# Altium schematic sheet SmartShell_Schematic.SchDoc: SmartShell
size A2
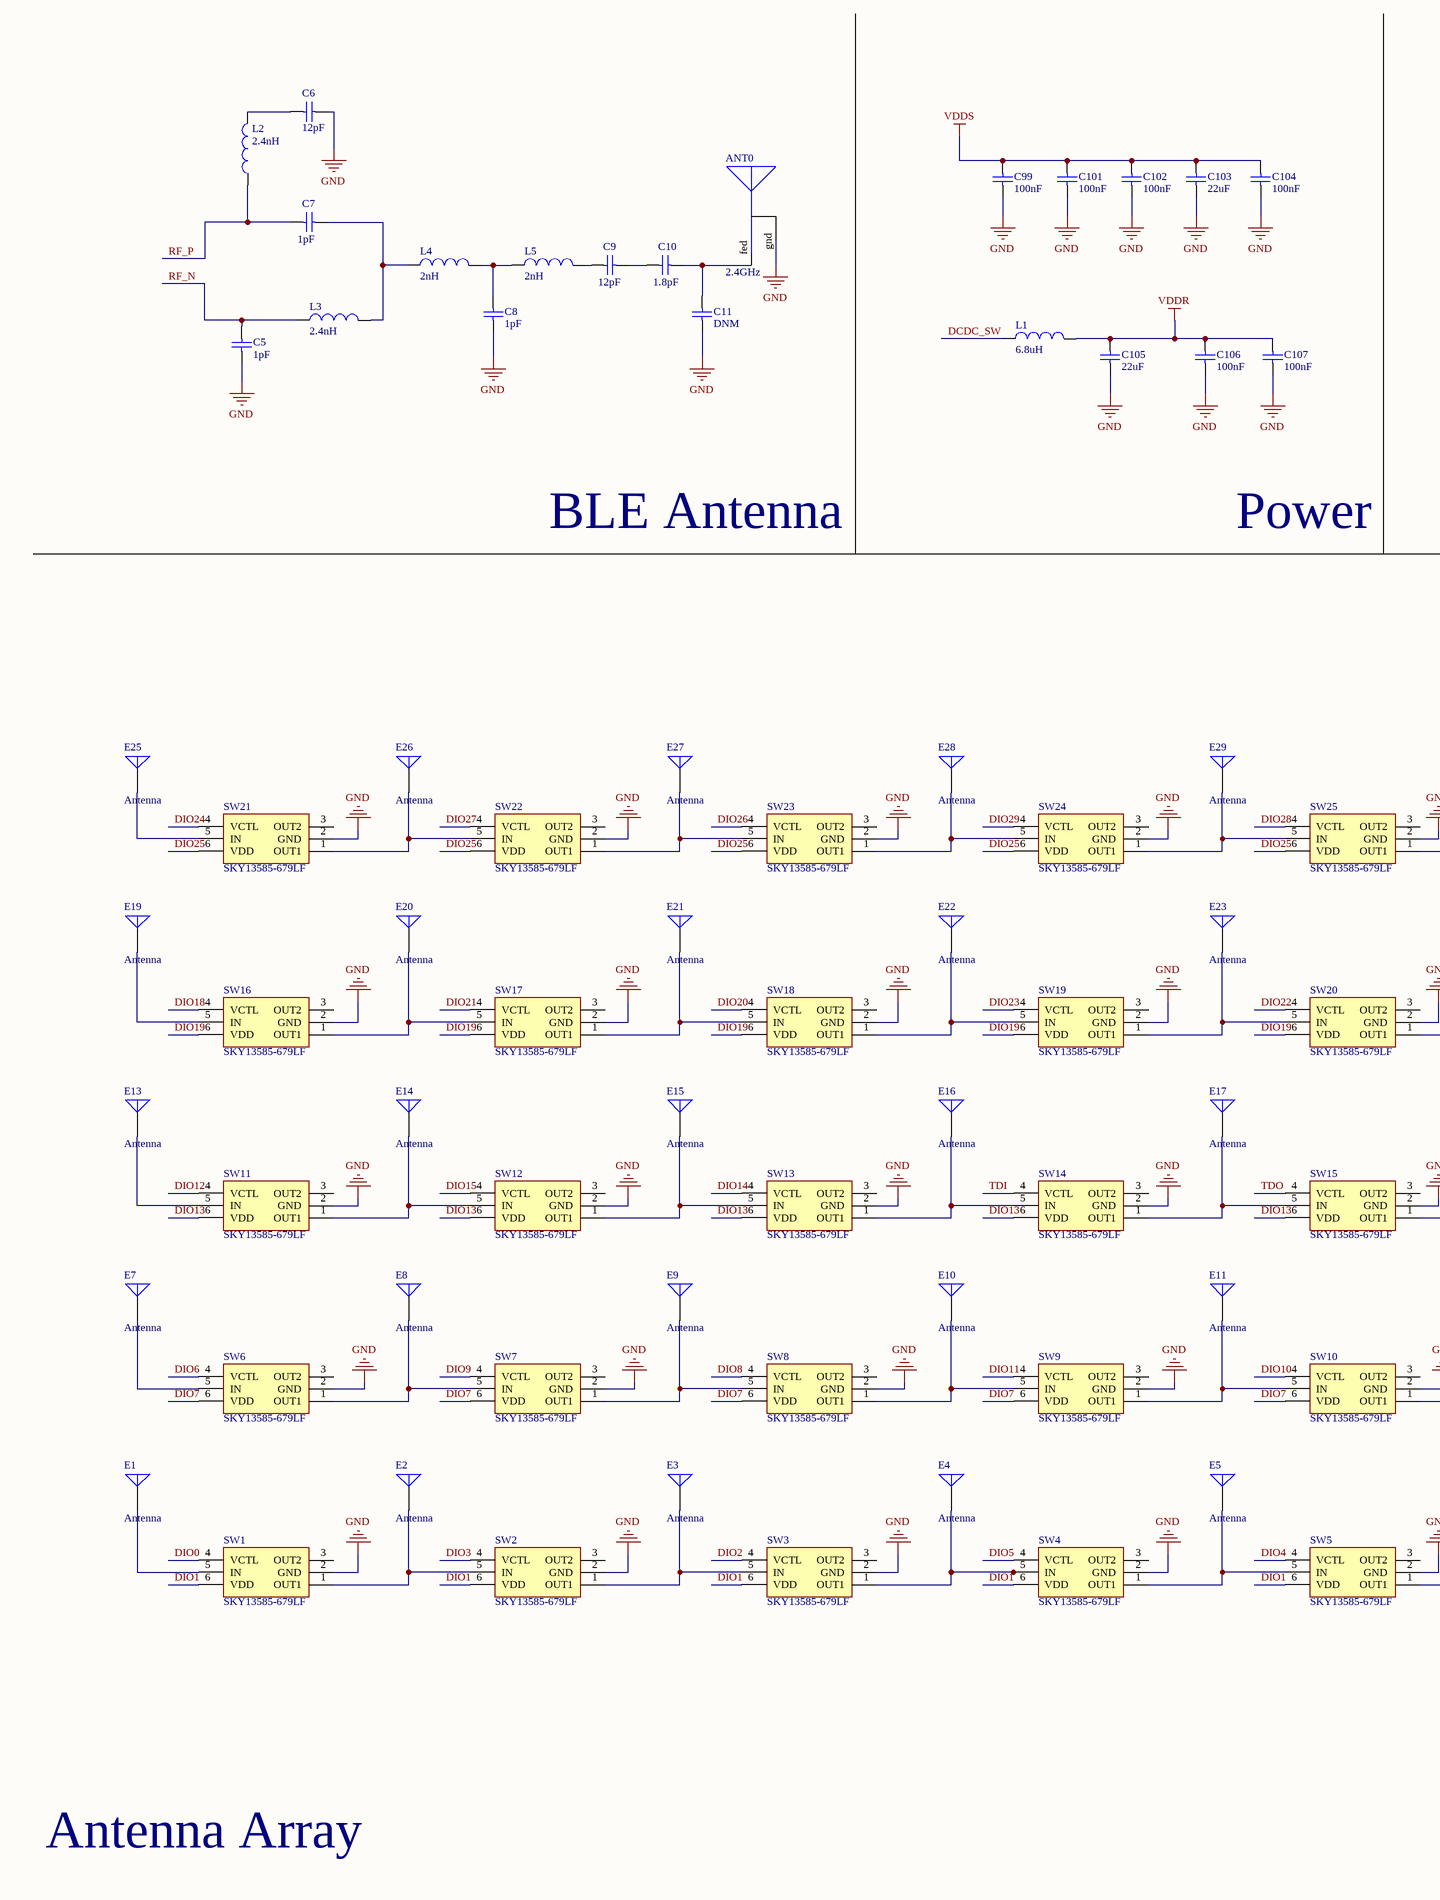
[diagram p0: SmartShell_Schematic.SchDoc, left]
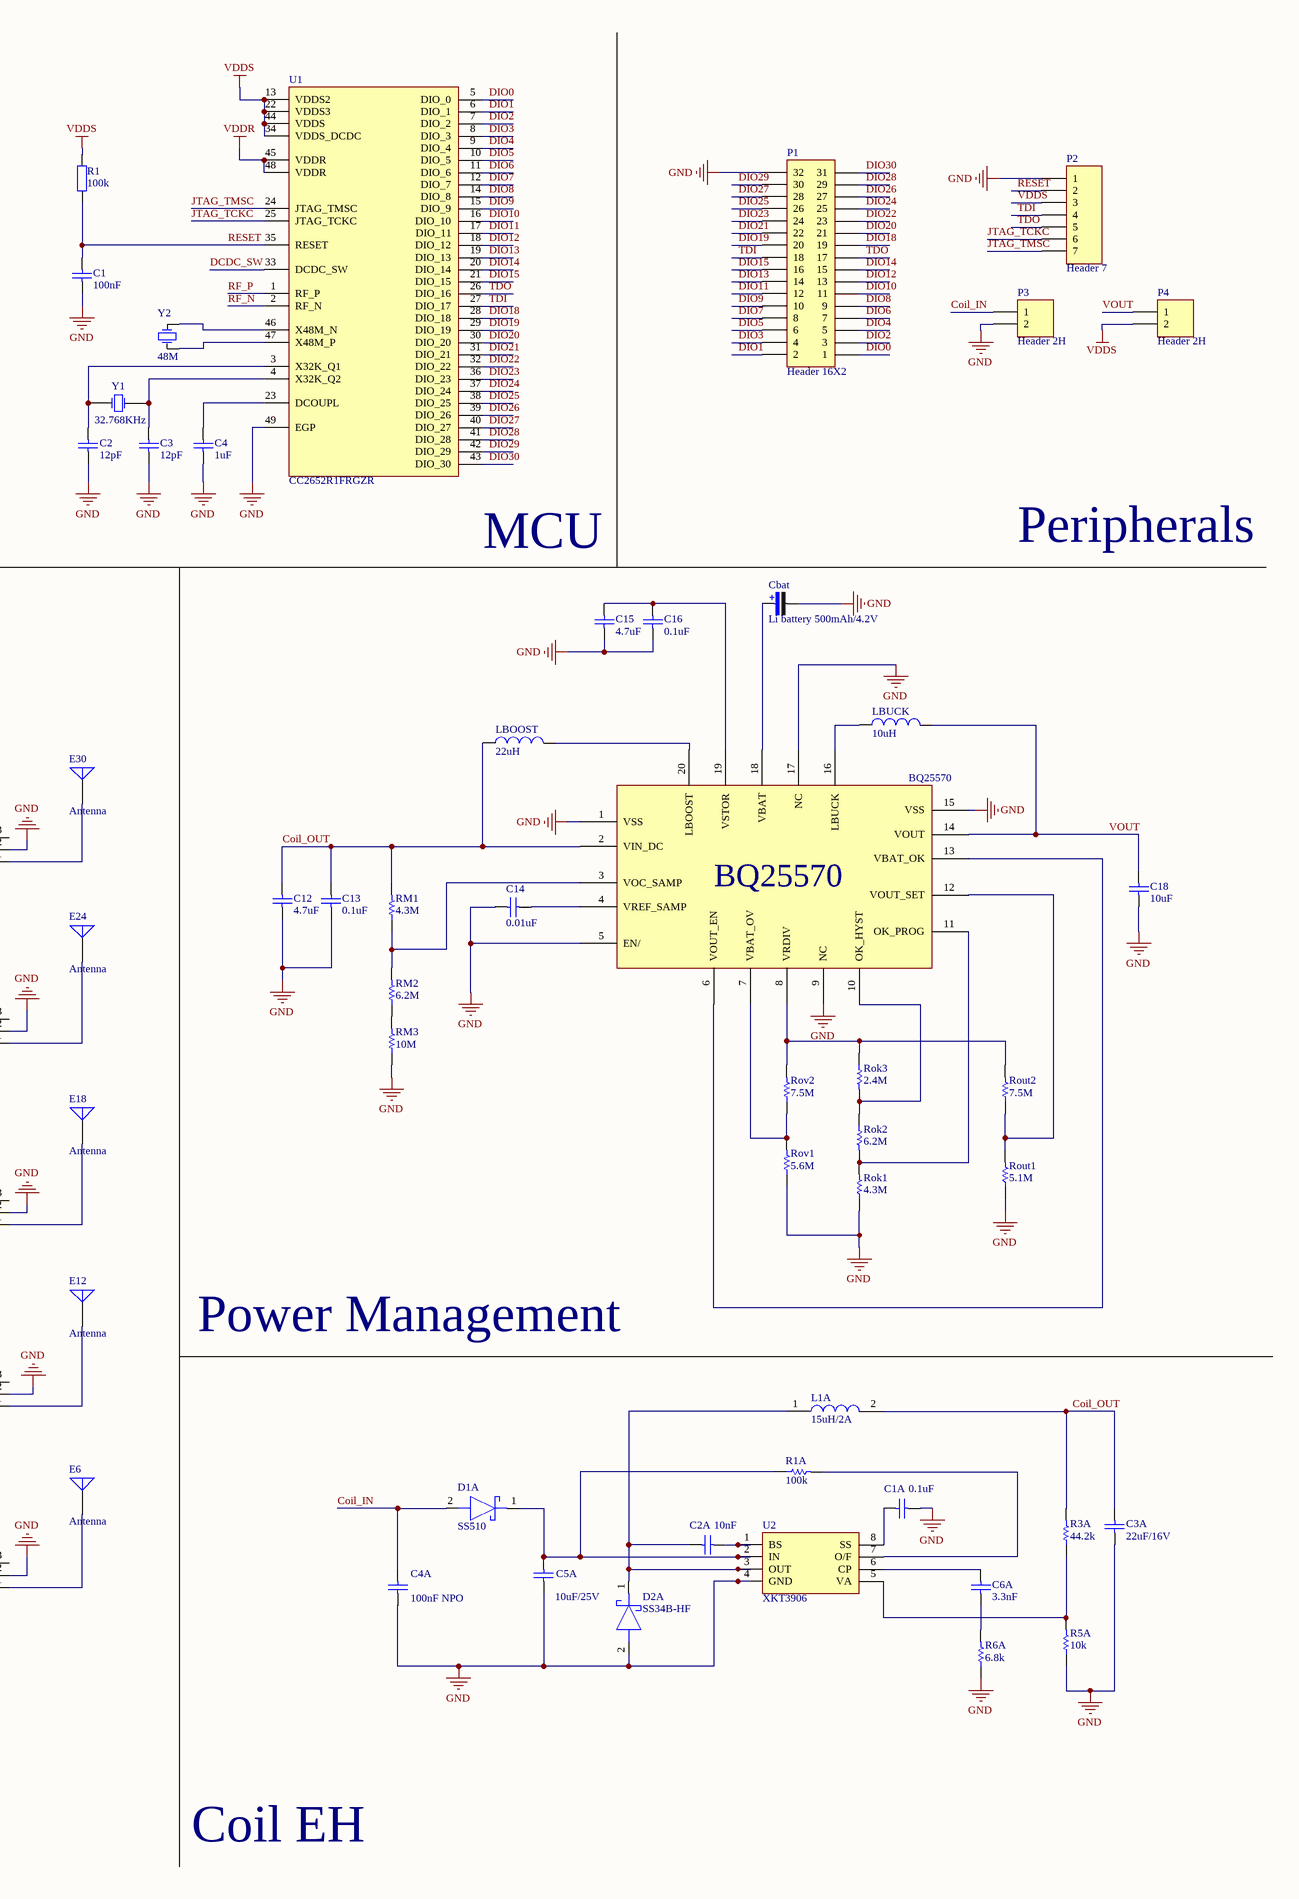
[diagram p1: SmartShell_Schematic.SchDoc, right]

## Parts
ANT0  2.4GHz  [PCBComponent_1]
BQ25570  (no value)
C1  value 100nF  [C-0603]  (hidden comment: Cap-S)
C1A  value 0.1uF  [0603]  (hidden comment: Cap)
C2  value 12pF  [C-0603]  (hidden comment: Cap-S)
C2A  value 10nF  [0603]  (hidden comment: Cap)
C3  value 12pF  [C-0603]  (hidden comment: Cap-S)
C3A  value 22uF/16V  [1206]  (hidden comment: Cap)
C4  value 1uF  [C-0603]  (hidden comment: Cap-S)
C4A  value 100nF NPO  [1206]  (hidden comment: Cap)
C5  value 1pF  [RAD-0.3]
C5A  value 10uF/25V  [1206]  (hidden comment: Cap)
C6  value 12pF  [RAD-0.3]
C6A  value 3.3nF  [0603]  (hidden comment: Cap)
C7  value 1pF  [RAD-0.3]
C8  value 1pF  [RAD-0.3]
C9  value 12pF  [RAD-0.3]
C10  value 1.8pF  [RAD-0.3]
C11  value DNM  [RAD-0.3]
C12  4.7uF  [1608[0603]]
C13  0.1uF  [1608[0603]]
C14  0.01uF  [1608[0603]]
C15  4.7uF  [1608[0603]]
C16  0.1uF  [1608[0603]]
C18  10uF  [1608[0603]]
C99  value 100nF  [C-0603]  (hidden comment: Cap-S)
C101  value 100nF  [C-0603]  (hidden comment: Cap-S)
C102  value 100nF  [C-0603]  (hidden comment: Cap-S)
C103  value 22uF  [C-0603]  (hidden comment: Cap-S)
C104  value 100nF  [C-0603]  (hidden comment: Cap-S)
C105  value 22uF  [C-0603]  (hidden comment: Cap-S)
C106  value 100nF  [C-0603]  (hidden comment: Cap-S)
C107  value 100nF  [C-0603]  (hidden comment: Cap-S)
Cbat  value Li battery 500mAh/4.2V  [C-RB-SD6]  (hidden comment: Cap-Pol-ES)
D1A  SS510  [DIOM7959X262N]
D2A  SS34B-HF  [DIOM5336X320N]
E1  Antenna  [PIN1]
E2  Antenna  [PIN1]
E3  Antenna  [PIN1]
E4  Antenna  [PIN1]
E5  Antenna  [PIN1]
E6  Antenna  [PIN1]
E7  Antenna  [PIN1]
E8  Antenna  [PIN1]
E9  Antenna  [PIN1]
E10  Antenna  [PIN1]
E11  Antenna  [PIN1]
E12  Antenna  [PIN1]
E13  Antenna  [PIN1]
E14  Antenna  [PIN1]
E15  Antenna  [PIN1]
E16  Antenna  [PIN1]
E17  Antenna  [PIN1]
E18  Antenna  [PIN1]
E19  Antenna  [PIN1]
E20  Antenna  [PIN1]
E21  Antenna  [PIN1]
E22  Antenna  [PIN1]
E23  Antenna  [PIN1]
E24  Antenna  [PIN1]
E25  Antenna  [PIN1]
E26  Antenna  [PIN1]
E27  Antenna  [PIN1]
E28  Antenna  [PIN1]
E29  Antenna  [PIN1]
E30  Antenna  [PIN1]
L1  value 6.8uH  [0402-A]
L1A  15uH/2A  [CD73NP331KC]
L2  value 2.4nH  [0402-A]
L3  value 2.4nH  [0402-A]
L4  value 2nH  [0402-A]
L5  value 2nH  [0402-A]
LBOOST  22uH  [0603]
LBUCK  10uH  [0603]
P1  Header 16X2  [HDR2X16]
P2  Header 7  [HDR1X7]
P3  Header 2H  [HDR1X2H]
P4  Header 2H  [HDR1X2H]
R1  value 100k  [0603-1]  (hidden comment: Res1)
R1A  value 100k  [0603]  (hidden comment: Res)
R3A  value 44.2k  [0603]  (hidden comment: Res)
R5A  value 10k  [0603]  (hidden comment: Res)
R6A  value 6.8k  [0603]  (hidden comment: Res)
RM1  4.3M  [0402]
RM2  6.2M  [0402]
RM3  10M  [0402]
Rok1  4.3M  [0402]
Rok2  6.2M  [0402]
Rok3  2.4M  [0402]
Rout1  5.1M  [0402]
Rout2  7.5M  [0402]
Rov1  5.6M  [0402]
Rov2  7.5M  [0402]
SW1  SKY13585-679LF
SW2  SKY13585-679LF
SW3  SKY13585-679LF
SW4  SKY13585-679LF
SW5  SKY13585-679LF
SW6  SKY13585-679LF
SW7  SKY13585-679LF
SW8  SKY13585-679LF
SW9  SKY13585-679LF
SW10  SKY13585-679LF
SW11  SKY13585-679LF
SW12  SKY13585-679LF
SW13  SKY13585-679LF
SW14  SKY13585-679LF
SW15  SKY13585-679LF
SW16  SKY13585-679LF
SW17  SKY13585-679LF
SW18  SKY13585-679LF
SW19  SKY13585-679LF
SW20  SKY13585-679LF
SW21  SKY13585-679LF
SW22  SKY13585-679LF
SW23  SKY13585-679LF
SW24  SKY13585-679LF
SW25  SKY13585-679LF
U1  CC2652R1FRGZR
U2  XKT3906
Y1  32.768KHz  [R38]
Y2  value 48M  [X-HC-49S]  (hidden comment: XTAL)

## Nets
GND: ANT0.gnd BQ25570.1(VSS) BQ25570.5(EN/) BQ25570.9(NC) BQ25570.15(VSS) BQ25570.17(NC) C1.1 C1A.1 C2.1 C3.1 C3A.2 C4.1 C4A.1 C5.2 C5A.1 C6.2 C8.1 C11.1 C12.1 C13.1 C14.2 C15.2 C16.1 C18.1 C99.1 C101.1 C102.1 C103.1 C104.1 C105.1 C106.1 C107.1 Cbat.2 D2A.2(A) P1.32 P2.1 P3.2 R5A.1 R6A.1 RM3.1 Rok1.1 Rout1.1 Rov1.1 SW1.2(GND) SW2.2(GND) SW3.2(GND) SW4.2(GND) SW5.2(GND) SW6.2(GND) SW7.2(GND) SW8.2(GND) SW9.2(GND) SW10.2(GND) SW11.2(GND) SW12.2(GND) SW13.2(GND) SW14.2(GND) SW15.2(GND) SW16.2(GND) SW17.2(GND) SW18.2(GND) SW19.2(GND) SW20.2(GND) SW21.2(GND) SW22.2(GND) SW23.2(GND) SW24.2(GND) SW25.2(GND) U1.49(EGP) U2.4(GND)
VDDR: C105.2 C106.2 C107.2 L1.2 U1.45(VDDR) U1.48(VDDR)
VDDS: C99.2 C101.2 C102.2 C103.2 C104.2 P2.3 P4.2 R1.2 U1.13(VDDS2) U1.22(VDDS3) U1.34(VDDS_DCDC) U1.44(VDDS)
Coil_IN: C4A.2 D1A.2(A) P3.1
Coil_OUT: BQ25570.2(VIN_DC) C3A.1 C12.2 C13.2 L1A.2 LBOOST.1 R3A.2 RM1.2
DCDC_SW: L1.1 U1.33(DCDC_SW)
DIO0: P1.1 SW1.4(VCTL) U1.5(DIO_0)
DIO1: P1.2 SW1.6(VDD) SW2.6(VDD) SW3.6(VDD) SW4.6(VDD) SW5.6(VDD) U1.6(DIO_1)
DIO2: P1.3 SW3.4(VCTL) U1.7(DIO_2)
DIO3: P1.4 SW2.4(VCTL) U1.8(DIO_3)
DIO4: P1.5 SW5.4(VCTL) U1.9(DIO_4)
DIO5: P1.6 SW4.4(VCTL) U1.10(DIO_5)
DIO6: P1.7 SW6.4(VCTL) U1.11(DIO_6)
DIO7: P1.8 SW6.6(VDD) SW7.6(VDD) SW8.6(VDD) SW9.6(VDD) SW10.6(VDD) U1.12(DIO_7)
DIO8: P1.9 SW8.4(VCTL) U1.14(DIO_8)
DIO9: P1.10 SW7.4(VCTL) U1.15(DIO_9)
DIO10: P1.11 SW10.4(VCTL) U1.16(DIO_10)
DIO11: P1.12 SW9.4(VCTL) U1.17(DIO_11)
DIO12: P1.13 SW11.4(VCTL) U1.18(DIO_12)
DIO13: P1.14 SW11.6(VDD) SW12.6(VDD) SW13.6(VDD) SW14.6(VDD) SW15.6(VDD) U1.19(DIO_13)
DIO14: P1.15 SW13.4(VCTL) U1.20(DIO_14)
DIO15: P1.16 SW12.4(VCTL) U1.21(DIO_15)
DIO18: P1.19 SW16.4(VCTL) U1.28(DIO_18)
DIO19: P1.20 SW16.6(VDD) SW17.6(VDD) SW18.6(VDD) SW19.6(VDD) SW20.6(VDD) U1.29(DIO_19)
DIO20: P1.21 SW18.4(VCTL) U1.30(DIO_20)
DIO21: P1.22 SW17.4(VCTL) U1.31(DIO_21)
DIO22: P1.23 SW20.4(VCTL) U1.32(DIO_22)
DIO23: P1.24 SW19.4(VCTL) U1.36(DIO_23)
DIO24: P1.25 SW21.4(VCTL) U1.37(DIO_24)
DIO25: P1.26 SW21.6(VDD) SW22.6(VDD) SW23.6(VDD) SW24.6(VDD) SW25.6(VDD) U1.38(DIO_25)
DIO26: P1.27 SW23.4(VCTL) U1.39(DIO_26)
DIO27: P1.28 SW22.4(VCTL) U1.40(DIO_27)
DIO28: P1.29 SW25.4(VCTL) U1.41(DIO_28)
DIO29: P1.30 SW24.4(VCTL) U1.42(DIO_29)
DIO30: P1.31 U1.43(DIO_30)
JTAG_TCKC: P2.6 U1.25(JTAG_TCKC)
JTAG_TMSC: P2.7 U1.24(JTAG_TMSC)
RESET: C1.2 P2.2 R1.1 U1.35(RESET)
RF_N: C5.1 L3.1 U1.2(RF_N)
RF_P: C7.1 L2.1 U1.1(RF_P)
TDI: P1.18 P2.4 SW14.4(VCTL) U1.27(DIO_17)
TDO: P1.17 P2.5 SW15.4(VCTL) U1.26(DIO_16)
VOUT: BQ25570.14(VOUT) C18.2 LBUCK.2 P4.1
NetANT0_fed: ANT0.fed C10.2 C11.2
NetBQ25570_3: BQ25570.3(VOC_SAMP) RM1.1 RM2.2
NetBQ25570_4: BQ25570.4(VREF_SAMP) C14.1
NetBQ25570_6: BQ25570.6(VOUT_EN) BQ25570.13(VBAT_OK)
NetBQ25570_7: BQ25570.7(VBAT_OV) Rov1.2 Rov2.1
NetBQ25570_8: BQ25570.8(VRDIV) Rok3.1 Rout2.2 Rov2.2
NetBQ25570_10: BQ25570.10(OK_HYST) Rok2.1 Rok3.2
NetBQ25570_11: BQ25570.11(OK_PROG) Rok1.2 Rok2.2
NetBQ25570_12: BQ25570.12(VOUT_SET) Rout1.2 Rout2.1
NetBQ25570_16: BQ25570.16(LBUCK) LBUCK.1
NetBQ25570_18: BQ25570.18(VBAT) Cbat.1
NetBQ25570_19: BQ25570.19(VSTOR) C15.1 C16.2
NetBQ25570_20: BQ25570.20(LBOOST) LBOOST.2
NetC1A_2: C1A.2 U2.8(SS)
NetC2_2: C2.2 U1.3(X32K_Q1) Y1.2(OSC2)
NetC2A_1: C2A.1 D2A.1(K) L1A.1 U2.3(OUT)
NetC2A_2: C2A.2 U2.1(BS)
NetC3_2: C3.2 U1.4(X32K_Q2) Y1.1(OSC1)
NetC4_2: C4.2 U1.23(DCOUPL)
NetC5A_2: C5A.2 D1A.1(K) R1A.1 U2.2(IN)
NetC6_1: C6.1 L2.2
NetC6A_1: C6A.1 R6A.2
NetC6A_2: C6A.2 U2.6(CP)
NetC7_2: C7.2 L3.2 L4.1
NetC8_2: C8.2 L4.2 L5.1
NetC9_1: C9.1 L5.2
NetC9_2: C9.2 C10.1
NetE1_1: E1.1(A) SW1.5(IN)
NetE2_1: E2.1(A) SW1.1(OUT1) SW2.5(IN)
NetE3_1: E3.1(A) SW2.1(OUT1) SW3.5(IN)
NetE4_1: E4.1(A) SW3.1(OUT1) SW4.5(IN)
NetE5_1: E5.1(A) SW4.1(OUT1) SW5.5(IN)
NetE6_1: E6.1(A) SW5.1(OUT1)
NetE7_1: E7.1(A) SW6.5(IN)
NetE8_1: E8.1(A) SW6.1(OUT1) SW7.5(IN)
NetE9_1: E9.1(A) SW7.1(OUT1) SW8.5(IN)
NetE10_1: E10.1(A) SW8.1(OUT1) SW9.5(IN)
NetE11_1: E11.1(A) SW9.1(OUT1) SW10.5(IN)
NetE12_1: E12.1(A) SW10.1(OUT1)
NetE13_1: E13.1(A) SW11.5(IN)
NetE14_1: E14.1(A) SW11.1(OUT1) SW12.5(IN)
NetE15_1: E15.1(A) SW12.1(OUT1) SW13.5(IN)
NetE16_1: E16.1(A) SW13.1(OUT1) SW14.5(IN)
NetE17_1: E17.1(A) SW14.1(OUT1) SW15.5(IN)
NetE18_1: E18.1(A) SW15.1(OUT1)
NetE19_1: E19.1(A) SW16.5(IN)
NetE20_1: E20.1(A) SW16.1(OUT1) SW17.5(IN)
NetE21_1: E21.1(A) SW17.1(OUT1) SW18.5(IN)
NetE22_1: E22.1(A) SW18.1(OUT1) SW19.5(IN)
NetE23_1: E23.1(A) SW19.1(OUT1) SW20.5(IN)
NetE24_1: E24.1(A) SW20.1(OUT1)
NetE25_1: E25.1(A) SW21.5(IN)
NetE26_1: E26.1(A) SW21.1(OUT1) SW22.5(IN)
NetE27_1: E27.1(A) SW22.1(OUT1) SW23.5(IN)
NetE28_1: E28.1(A) SW23.1(OUT1) SW24.5(IN)
NetE29_1: E29.1(A) SW24.1(OUT1) SW25.5(IN)
NetE30_1: E30.1(A) SW25.1(OUT1)
NetR1A_2: R1A.2 U2.7(O/F)
NetR3A_1: R3A.1 R5A.2 U2.5(VA)
NetRM2_1: RM2.1 RM3.2
NetU1_46: U1.46(X48M_N) Y2.2(OSC2)
NetU1_47: U1.47(X48M_P) Y2.1(OSC1)

Not connected (* = marked no-connect by the designer): SW1 3(OUT2); SW2 3(OUT2); SW3 3(OUT2); SW4 3(OUT2); SW5 3(OUT2); SW6 3(OUT2); SW7 3(OUT2); SW8 3(OUT2); SW9 3(OUT2); SW10 3(OUT2); SW11 3(OUT2); SW12 3(OUT2); SW13 3(OUT2); SW14 3(OUT2); SW15 3(OUT2); SW16 3(OUT2); SW17 3(OUT2); SW18 3(OUT2); SW19 3(OUT2); SW20 3(OUT2); SW21 3(OUT2); SW22 3(OUT2); SW23 3(OUT2); SW24 3(OUT2); SW25 3(OUT2)

## Notes on the sheet
- BLE Antenna
- Power
- MCU
- Peripherals
- (near BQ25570) BQ25570
- Power Management
- Antenna Array
- Coil EH

## Library data of the parts
ANT0 = AN043: 2.4GHz small RF-antenna
BQ25570 SW1-SW25 U1 U2 = Component_1
C1-C4 C99 C101-C107 = Cap-S: 贴片瓷片电容; Published: 8-Jun-2000; LatestRevisionDate: 17-Jul-2002; LatestRevisionNote: Re-released for DXP Platform.; PackageReference: RAD-0.3; Publisher: Altium Limited
C1A C2A C3A C4A C5 C5A C6 C6A C7-C16 C18 = Cap: Capacitor; Published: 8-Jun-2000; LatestRevisionDate: 17-Jul-2002; LatestRevisionNote: Re-released for DXP Platform.; PackageReference: RAD-0.3; Publisher: Altium Limited; PackageDescription: Radial Cap, Thru-Hole; 2 Leads; 0.3 in Pin Spacing
Cbat = Cap-Pol-ES: 贴片铝电解电容; Published: 8-Jun-2000; LatestRevisionDate: 17-Jul-2002; LatestRevisionNote: Re-released for DXP Platform.; PackageReference: RB7.6-15; Publisher: Altium Limited
D1A = SS510: Schottky Diode; Manufacturer_Name: MDD (Microdiode Electronics); Datasheet Link: https://datasheet.lcsc.com/szlcsc/1903042030_MDD-Jiangsu-Yutai-Elec-SS510_C19229.pdf; Height: 2.62mm; Manufacturer_Part_Number: SS510
D2A = SS34B-HF: Schottky Diode; Manufacturer_Name: Comchip Technology; Datasheet Link: https://www.mouser.jp/datasheet/2/80/SP-JB017_SS34B-HF_Thru._SS320B-HF_RevB-1847021.pdf; Height: 3.2mm; Manufacturer_Part_Number: SS34B-HF
E1-E30 = Antenna: Generic Antenna; Published: 24-Mar-1999; LatestRevisionDate: 17-Jul-2002; LatestRevisionNote: Re-released for DXP Platform.; PackageReference: PIN1; Publisher: Altium Limited
L1-L5 LBOOST LBUCK = Inductor: Code_IEC: 1005; Published: 8-Jun-2000; LatestRevisionDate: 29-May-2009; LatestRevisionNote: IPC-7351 Footprint Added.; PackageReference: 0402-A; Publisher: Altium Limited; PackageDescription: Chip Inductor; Code_JEITA: 0402
L1A = CD73NP-331KC: Inductor; Manufacturer_Name: Sumida; Datasheet Link: https://products.sumida.com/products/pdf/CD73.pdf; Height: 4mm; Manufacturer_Part_Number: CD73NP-331KC; Mouser Part Number: 851-CD73NP-331KC; Mouser Price/Stock: https://www.mouser.com/Search/Refine.aspx?Keyword=851-CD73NP-331KC
P1 = Header 16X2: Header, 16-Pin, Dual row; LatestRevisionDate: 17-Jul-2002; LatestRevisionNote: Re-released for DXP Platform.; Publisher: Altium Limited
P2 = Header 7: Header, 7-Pin; LatestRevisionDate: 17-Jul-2002; LatestRevisionNote: Re-released for DXP Platform.; Publisher: Altium Limited
P3 P4 = Header 2H: Header, 2-Pin, Right Angle; LatestRevisionDate: 17-Jul-2002; LatestRevisionNote: Re-released for DXP Platform.; Publisher: Altium Limited
R1 = Res1: 贴片电阻; Published: 8-Jun-2000; LatestRevisionDate: 17-Jul-2002; LatestRevisionNote: Re-released for DXP Platform.; PackageReference: AXIAL-0.4; Publisher: Altium Limited
R1A R3A R5A R6A = Res: Chip Resistor (Surface Mount); Manufacturer: Generic Chip Res (TBD); Manufacturer Part Number: *; Digi-Key Part Number: *; Rating: *
RM1-RM3 Rok1-Rok3 Rout1 Rout2 Rov1 Rov2 = Res1: Resistor; Published: 8-Jun-2000; LatestRevisionDate: 17-Jul-2002; LatestRevisionNote: Re-released for DXP Platform.; PackageReference: AXIAL-0.3; Publisher: Altium Limited; PackageDescription: Axial Device, Thru-Hole; 2 Leads; 0.3 in Pin Spacing
Y1 = XTAL: Crystal Oscillator; Published: 8-Jun-2000; LatestRevisionDate: 17-Jul-2002; LatestRevisionNote: Re-released for DXP Platform.; PackageReference: R38; Publisher: Altium Limited; PackageDescription: Crystal, Thru-Hole; 2 Leads; Body 3.1 x 8.2 mm (Dia.xH)
Y2 = XTAL: 晶振; Published: 8-Jun-2000; LatestRevisionDate: 17-Jul-2002; LatestRevisionNote: Re-released for DXP Platform.; PackageReference: R38; Publisher: Altium Limited